# Altium schematic sheet STM32G473RET6_PINOUT.SchDoc
size C; SheetNumber: 5; SheetTotal: 5
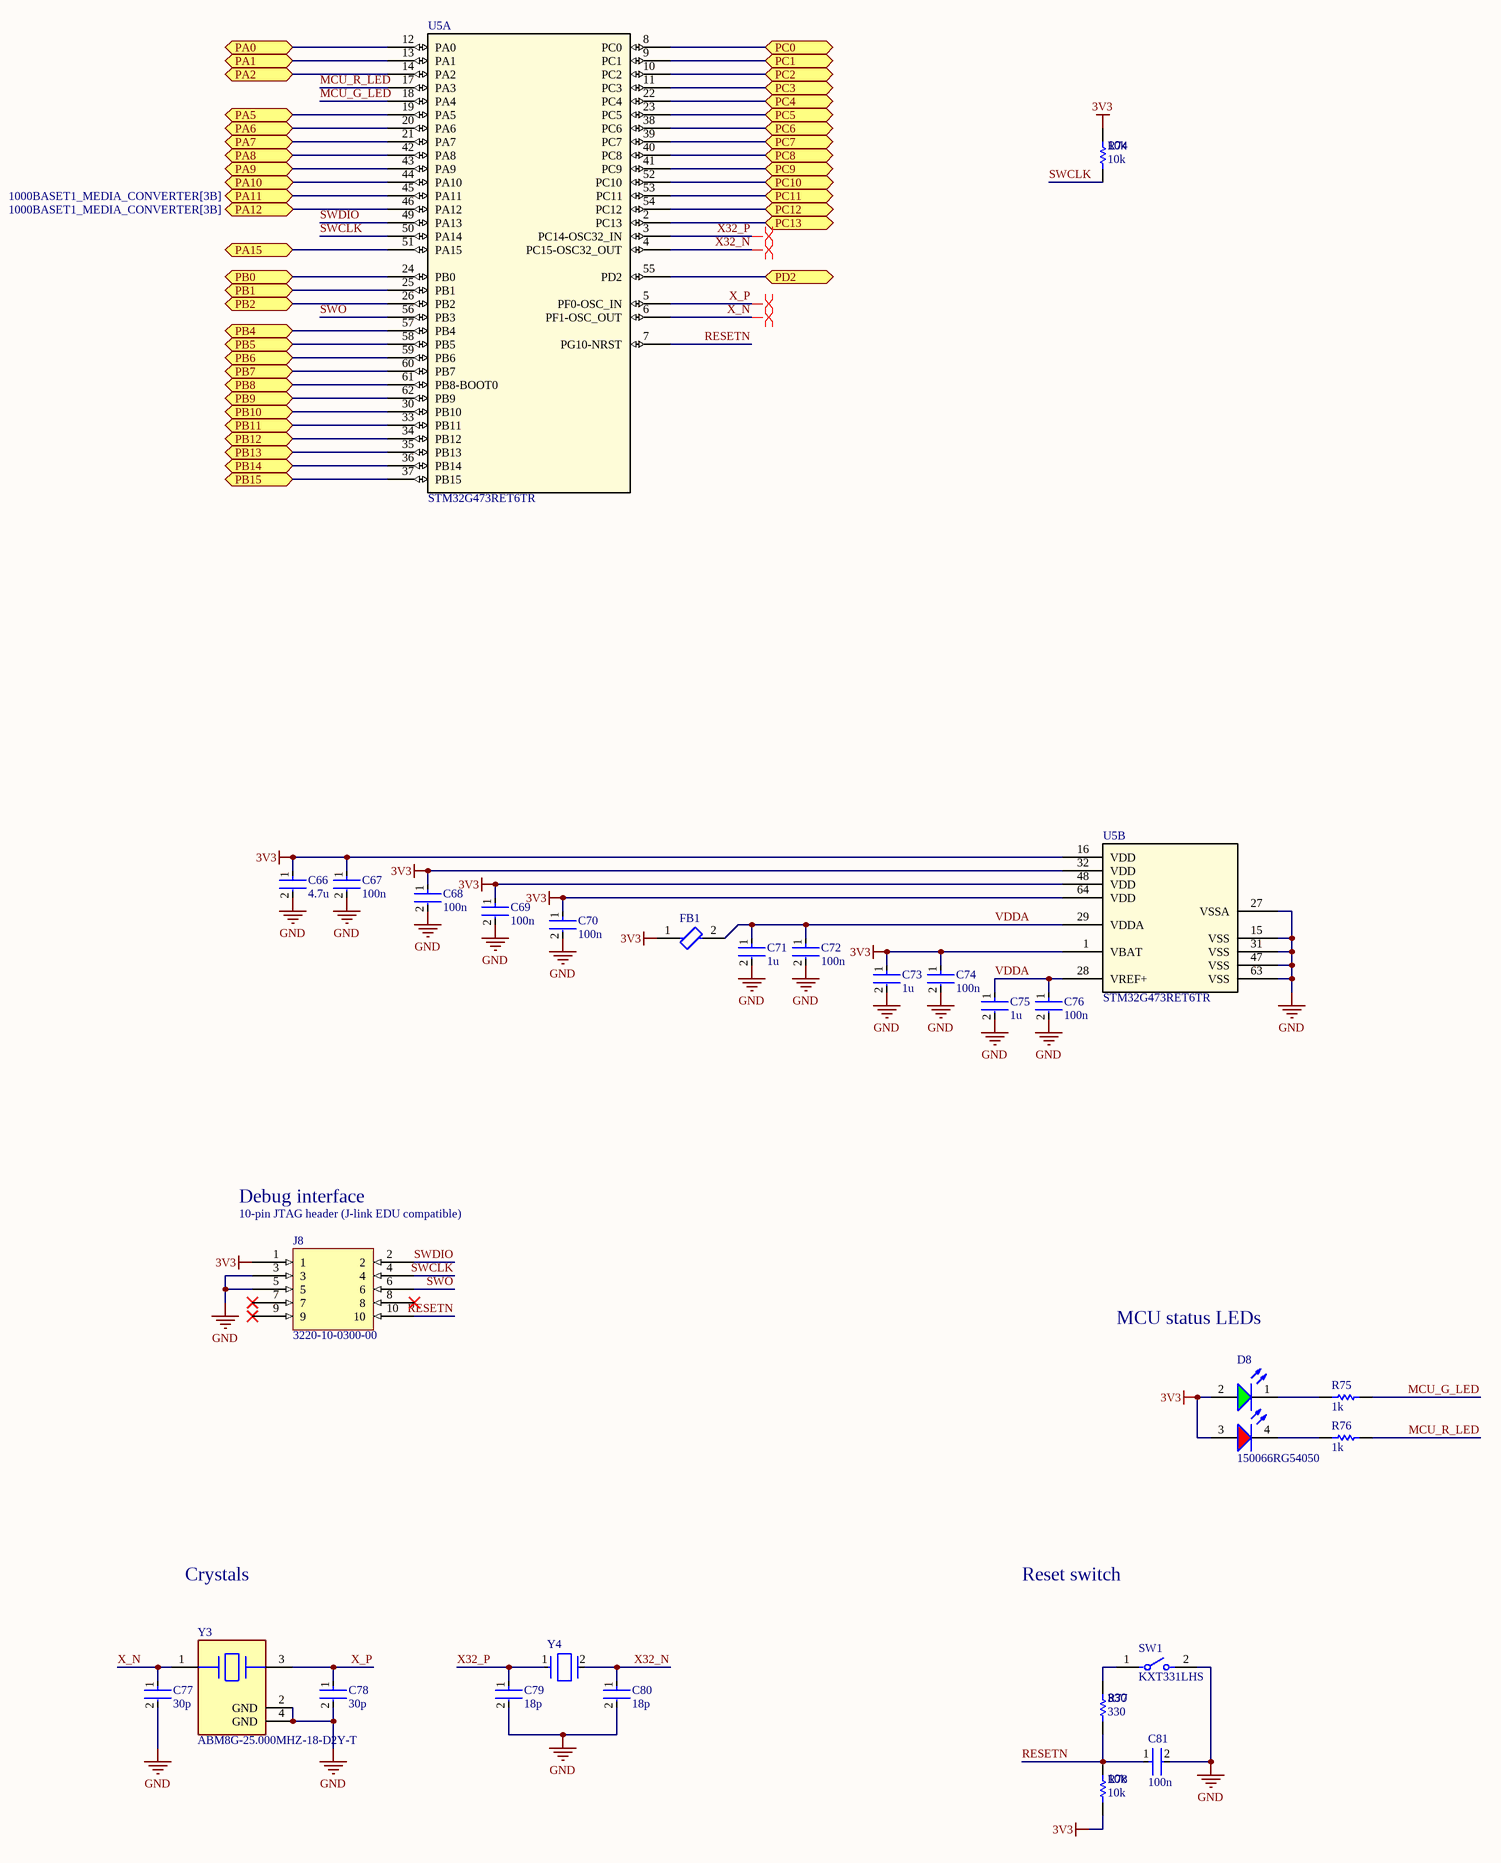
[diagram p0: STM32G473RET6_PINOUT.SchDoc]

## Parts
C66  4.7u  [FP-0402-L_1_0_0_05-W_0_5-IPC_A]
C67  100n  [FP-0402-L_1_0_0_05-W_0_5-IPC_A]
C68  100n  [FP-0402-L_1_0_0_05-W_0_5-IPC_A]
C69  100n  [FP-0402-L_1_0_0_05-W_0_5-IPC_A]
C70  100n  [FP-0402-L_1_0_0_05-W_0_5-IPC_A]
C71  1u  [FP-0402-L_1_0_0_05-W_0_5-IPC_A]
C72  100n  [FP-0402-L_1_0_0_05-W_0_5-IPC_A]
C73  1u  [FP-0402-L_1_0_0_05-W_0_5-IPC_A]
C74  100n  [FP-0402-L_1_0_0_05-W_0_5-IPC_A]
C75  1u  [FP-0402-L_1_0_0_05-W_0_5-IPC_A]
C76  100n  [FP-0402-L_1_0_0_05-W_0_5-IPC_A]
C77  30p  [FP-0402-L_1_0_0_05-W_0_5-IPC_A]
C78  30p  [FP-0402-L_1_0_0_05-W_0_5-IPC_A]
C79  18p  [FP-0402-L_1_0_0_05-W_0_5-IPC_A]
C80  18p  [FP-0402-L_1_0_0_05-W_0_5-IPC_A]
C81  100n  [FP-0402-L_1_0_0_05-W_0_5-IPC_A]
D8  150066RG54050  [WL-SBCD_0606]
FB1  BLM15PX601SN1D  [FP-BLM15-0_05-MFG]  (value not drawn)
J8  3220-10-0300-00  [3220-10-0300-00-Footprint-1]
R74  10k  [R0603B]
R75  1k  [R0603B]
R76  1k  [R0603B]
R77  330  [R0603B]
R78  10k  [R0603B]
SW1  KXT331LHS  [FP-KXT331LHS-MFG]
U5  STM32G473RET6TR  [STM32G473RET6TR-Footprint-1]  (parts A,B of 2)
Y3  ABM8G-25.000MHZ-18-D2Y-T  [FP-ABM8G-MFG]
Y4  ECS-.327-12.5-1210-TR  [FP-ECX-1210-MFG]  (value not drawn)

## Ports
PA0 (bidir), PA1 (bidir), PA2 (bidir), PA5 (bidir), PA6 (bidir), PA7 (bidir), PA8 (bidir), PA9 (bidir), PA10 (bidir), PA11 (bidir, see 1000BASET1_MEDIA_CONVERTER[3B]), PA12 (bidir, see 1000BASET1_MEDIA_CONVERTER[3B]), PA15 (bidir), PB0 (bidir), PB1 (bidir), PB2 (bidir), PB4 (bidir), PB5 (bidir), PB6 (bidir), PB7 (bidir), PB8 (bidir), PB9 (bidir), PB10 (bidir), PB11 (bidir), PB12 (bidir), PB13 (bidir), PB14 (bidir), PB15 (bidir), PC0 (bidir), PC1 (bidir), PC2 (bidir), PC3 (bidir), PC4 (bidir), PC5 (bidir), PC6 (bidir), PC7 (bidir), PC8 (bidir), PC9 (bidir), PC10 (bidir), PC11 (bidir), PC12 (bidir), PC13 (bidir), PD2 (bidir)

## Nets
3V3: C66.1 C67.1 C68.1 C69.1 C70.1 C73.1 C74.1 D8.2(A) D8.3(A) FB1.1 J8.1 R74.2 R78.1 U5.1(VBAT) U5.16(VDD) U5.32(VDD) U5.48(VDD) U5.64(VDD)
GND: C66.2 C67.2 C68.2 C69.2 C70.2 C71.2 C72.2 C73.2 C74.2 C75.2 C76.2 C77.2 C78.2 C79.2 C80.2 C81.2 J8.3 J8.5 SW1.2 U5.15(VSS) U5.27(VSSA) U5.31(VSS) U5.47(VSS) U5.63(VSS) Y3.2(GND) Y3.4(GND)
MCU_G_LED: R75.1 U5.18(PA4)
MCU_R_LED: R76.1 U5.17(PA3)
PA0: U5.12(PA0) ; port PA0
PA1: U5.13(PA1) ; port PA1
PA2: U5.14(PA2) ; port PA2
PA5: U5.19(PA5) ; port PA5
PA6: U5.20(PA6) ; port PA6
PA7: U5.21(PA7) ; port PA7
PA8: U5.42(PA8) ; port PA8
PA9: U5.43(PA9) ; port PA9
PA10: U5.44(PA10) ; port PA10
PA11: U5.45(PA11) ; port PA11
PA12: U5.46(PA12) ; port PA12
PA15: U5.51(PA15) ; port PA15
PB0: U5.24(PB0) ; port PB0
PB1: U5.25(PB1) ; port PB1
PB2: U5.26(PB2) ; port PB2
PB4: U5.57(PB4) ; port PB4
PB5: U5.58(PB5) ; port PB5
PB6: U5.59(PB6) ; port PB6
PB7: U5.60(PB7) ; port PB7
PB8: U5.61(PB8-BOOT0) ; port PB8
PB9: U5.62(PB9) ; port PB9
PB10: U5.30(PB10) ; port PB10
PB11: U5.33(PB11) ; port PB11
PB12: U5.34(PB12) ; port PB12
PB13: U5.35(PB13) ; port PB13
PB14: U5.36(PB14) ; port PB14
PB15: U5.37(PB15) ; port PB15
PC0: U5.8(PC0) ; port PC0
PC1: U5.9(PC1) ; port PC1
PC2: U5.10(PC2) ; port PC2
PC3: U5.11(PC3) ; port PC3
PC4: U5.22(PC4) ; port PC4
PC5: U5.23(PC5) ; port PC5
PC6: U5.38(PC6) ; port PC6
PC7: U5.39(PC7) ; port PC7
PC8: U5.40(PC8) ; port PC8
PC9: U5.41(PC9) ; port PC9
PC10: U5.52(PC10) ; port PC10
PC11: U5.53(PC11) ; port PC11
PC12: U5.54(PC12) ; port PC12
PC13: U5.2(PC13) ; port PC13
PD2: U5.55(PD2) ; port PD2
RESETN: C81.1 J8.10 R77.1 R78.2 U5.7(PG10-NRST)
SWCLK: J8.4 R74.1 U5.50(PA14)
SWDIO: J8.2 U5.49(PA13)
SWO: J8.6 U5.56(PB3)
VDDA: C71.1 C72.1 C75.1 C76.1 FB1.2 U5.28(VREF+) U5.29(VDDA)
X32_N: C80.1 U5.4(PC15-OSC32_OUT) Y4.2(Out/In)
X32_P: C79.1 U5.3(PC14-OSC32_IN) Y4.1(In/Out)
X_N: C77.1 U5.6(PF1-OSC_OUT) Y3.1
X_P: C78.1 U5.5(PF0-OSC_IN) Y3.3
NetD8_1: D8.1(K) R75.2
NetD8_4: D8.4(K) R76.2
NetR77_2: R77.2 SW1.1

Not connected (* = marked no-connect by the designer): J8 7* 8* 9*

## Layout directives
differential pair: X32_N, X32_P, X_N, X_P

## Notes on the sheet
- Debug interface
- (near J8) 10-pin JTAG header (J-link EDU compatible)
- MCU status LEDs
- Crystals
- Reset switch

## Library data of the parts
C66-C81 = CMP-001-00058-1: LARGE PADS, 0402 CAP, CHANGE COMMENT TO MATCH REAL P/N; Capacitor Type: Ceramic; Min Operating Temperature: -55°C; Mounting Technology: Surface Mount; Pins: 2; Case/Package: 0402; RoHS Compliant: Yes; Max Operating Temperature: 85°C
  C66: Value: 4.7u
  C67-C70 C72 C74 C76 C81: Value: 100n
  C71 C73 C75: Value: 1u
  C77 C78: Value: 30p
  C79 C80: Value: 18p
D8 = CMP-004-00040-2: Led, Red/Grn, 180Mcd/230Mcd, 624Nm/525Nm Rohs Compliant: Yes; Source: rgled.SchLib; Component Type: Standard; Design Item ID: CMP-004-00034-2; Pins: 4
FB1 = CMP-0686-00252-4: Chip Ferrite Bead, 0402, 600Ω @ 100MHz, 0.23Ω, 25%, 900mA; Number of Circuits: 1; Impedance: 600R; DC Resistance (DCR): 230mR; Material: Steel; Length: 1mm; Package Quantity: 10000; Height: 0.5mm; Width: 0.5mm; Max DC Current: 900mA; Number of Lines: 1; Termination: SMD/SMT; Packaging: Tape and Reel; Lead Free: Lead Free; Min Operating Temperature: -55°C; Max Operating Temperature: 125°C; Max Current Rating: 900mA; Case Code (Imperial): 0402; Number of Pins: 2; Current Rating: 900mA; Test Frequency: 100MHz; Case/Package: 0402; Tolerance: 25%; Case Code (Metric): 1005
J8 = CMP-001-0013-3: CONN HEADER SMD 10POS 1.27MM
R74-R78 = CMP-009-00002-14: Resistor
  R74 R78: Value: 10k
  R75 R76: Value: 1k
  R77: Value: 330
SW1 = CMP-10040-000029-1: SWITCH TACTILE SPST-NO 0.02A 15V; Operating Force: 240gf; Switch Travel: 0.13mm; Illumination Type: Non-Illuminated; Throw Configuration: SPST; Number of Ports: 1; Current Rating: 5A; Mechanical Life: 500000Cycles; Switch Function: Off-Mom; Connector Type: USB; Actuator Type: Standard; Gender: Receptacle; Number of Contacts: 24; Contact Plating: Gold; Insulation Color: Black; Min Operating Temperature: -40°C; Packaging: Tape and Reel; Flammability Rating: UL94 V-0; Max Operating Temperature: 85°C; Termination: Solder; Mount: Surface Mount
U5 = CMP-020-00020-2: MCU 32-Bit STM32 ARM Cortex-M4 RISC 512KB Flash 1.71V to 3.6V 64-Pin LQFP T/R; RoHS Compliant: Yes
Y3 = CMP-2000-05733-3: Crystal 25MHz ±20ppm (Tol) ±30ppm (Stability) 18pF FUND 60Ω 4-Pin SMD T/R; Series Resistance: 60R; Length: 3.2mm; Depth: 2.5mm; Packaging: Tape and Reel; Min Operating Temperature: -40°C; Operating Frequency: 25 MHz; Lead Free: Lead Free; Number of Pins: 4; Frequency Tolerance: 20ppm; Radiation Hardening: No; Max Operating Temperature: 85°C; Termination: SMD/SMT; Frequency Stability: 30ppm; Frequency: 25MHz; Series: ABM8G; Mount: Surface Mount; Package Quantity: 1000; Height: 0.039inch; Width: 0.098inch; Case/Package: CSMD; ESR (Equivalent Series Resistance): 60R; Load Capacitance: 18pF; Tolerance: 20ppm
Y4 = CMP-40224-000006-1: CRYSTAL 32.7680KHZ 12.5PF SMD; Manufacturer: ECS International; Frequency: 32.768kHz; Esr: 90kΩ; Tolerance: 20ppm; Device Class L1: Passive Components; Load Capacitance: 12.5pF; Temperature: -40°C to +85°C; ComponentLink2URL: https://ecsxtal.com/store/pdf/ECX-1210.pdf; Series: ECX-1210; Octopart: https://octopart.com/ecs-.327-12.5-1210-tr-ecs+international-81221340; ComponentLink2Description: Datasheet; Temperature Range Low: -40°C; Digikey Description: CRYSTAL 32.7680KHZ 12.5PF SMD; Lead Free: Yes; RoHS: TRUE; Device Class L3: Crystals; Automotive: No; Category: Crys; Height: 0.5mm; Manufacturer Part Number: ECS-.327-12.5-1210-TR; Temperature Range High: +85°C; Device Class L2: Crystals / Oscillators; Package: ECX-1210